# Altium schematic sheet Stm32_Minimum_Board_V1.0.SchDoc
size A3; Razrabotal: Булатов
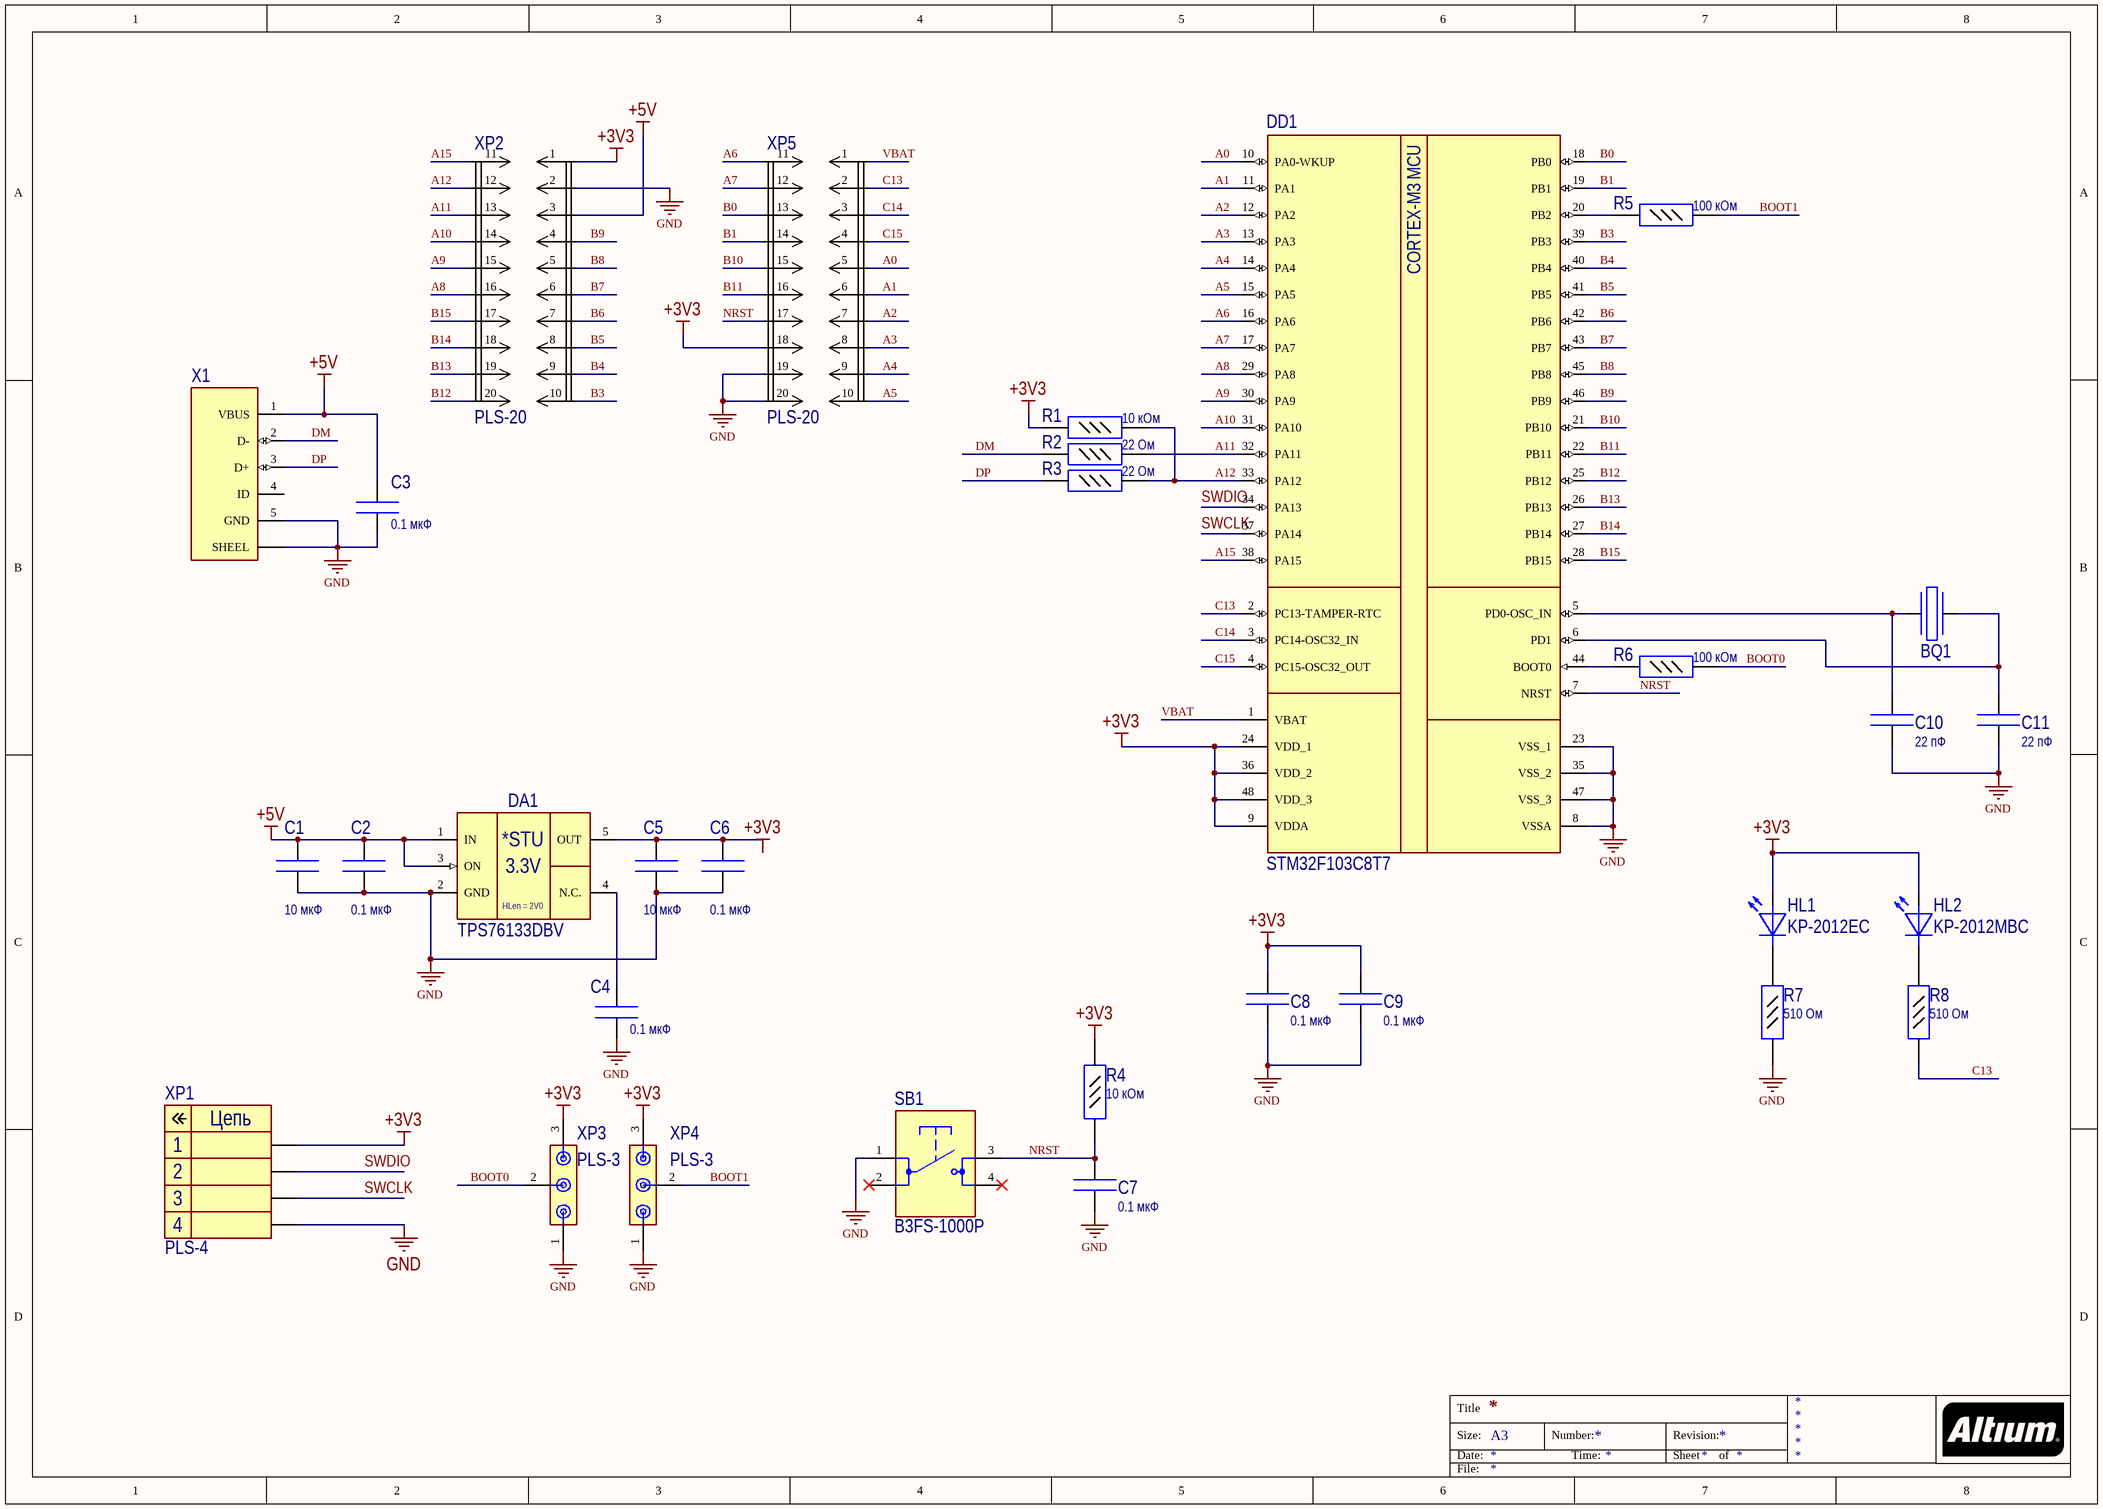
[diagram p0: Stm32_Minimum_Board_V1.0.SchDoc]

## Parts
BQ1  HC-49SMD  [HC49-SMD]  (value not drawn)
C1  value 10 мкФ  [CC0805]  (hidden comment: CC0805-X7R-10 мкФ-20%-25В)
C2  value 0.1 мкФ  [CC0603]  (hidden comment: CC0603-X5R-0.1 мкФ-20%-10В)
C3  value 0.1 мкФ  [CC0603]  (hidden comment: CC0603-X5R-0.1 мкФ-20%-10В)
C4  value 0.1 мкФ  [CC0603]  (hidden comment: CC0603-X5R-0.1 мкФ-20%-10В)
C5  value 10 мкФ  [CC0805]  (hidden comment: CC0805-X7R-10 мкФ-20%-25В)
C6  value 0.1 мкФ  [CC0603]  (hidden comment: CC0603-X5R-0.1 мкФ-20%-10В)
C7  value 0.1 мкФ  [CC0603]  (hidden comment: CC0603-X5R-0.1 мкФ-20%-10В)
C8  value 0.1 мкФ  [CC0603]  (hidden comment: CC0603-X5R-0.1 мкФ-20%-10В)
C9  value 0.1 мкФ  [CC0603]  (hidden comment: CC0603-X5R-0.1 мкФ-20%-10В)
C10  value 22 пФ  [CC0603]  (hidden comment: CC0603-X7R-22 пФ-20%-25В)
C11  value 22 пФ  [CC0603]  (hidden comment: CC0603-X7R-22 пФ-20%-25В)
DA1  TPS76133DBV  [TSOP-5]
DD1  STM32F103C8T7  [LQFP50P700x700-48]
HL1  KP-2012EC  [KP-2012-RED]
HL2  KP-2012MBC  [KP-2012-BL]
R1  value 10 кОм  [CR0603]  (hidden comment: CR0603-10 кОм-±5%)
R2  value 22 Ом  [CR0603]  (hidden comment: CR0603-22 Ом-±5%)
R3  value 22 Ом  [CR0603]  (hidden comment: CR0603-22 Ом-±5%)
R4  value 10 кОм  [CR0603]  (hidden comment: CR0603-10 кОм-±5%)
R5  value 100 кОм  [CR0603]  (hidden comment: CR0603-100 кОм-±5%)
R6  value 100 кОм  [CR0603]  (hidden comment: CR0603-100 кОм-±5%)
R7  value 510 Ом  [CR0603]  (hidden comment: CR0603-510 Ом-±5%)
R8  value 510 Ом  [CR0603]  (hidden comment: CR0603-510 Ом-±5%)
SB1  B3FS-1000P  [B3FS-10xx]
X1  microUSB-AB (475900001 Molex)  [microUSB-AB PCB (475900001 Molex)]  (value not drawn)
XP1  PLS-4  [PLS-4]
XP2  PLS-20  [PLS-20]
XP3  PLS-3  [PLS-3]
XP4  PLS-3  [PLS-3]
XP5  PLS-20  [PLS-20]

## Nets
+3V3: C8.1(+) C9.1(+) DD1.9(VDDA) DD1.24(VDD_1) DD1.36(VDD_2) DD1.48(VDD_3) HL1.1(A) HL2.1(A) R1.2(-) R4.1(+) XP1.1 XP2.1 XP3.3 XP4.3 XP5.18
+5V: C1.1(+) C2.1(+) C3.1(+) DA1.1(IN) DA1.3(ON) X1.1(VBUS) XP2.3
GND: C1.2(-) C2.2(-) C3.2(-) C4.2(-) C5.2(-) C6.2(-) C7.2(-) C8.2(-) C9.2(-) C10.2(-) C11.2(-) DA1.2(GND) DD1.8(VSSA) DD1.23(VSS_1) DD1.35(VSS_2) DD1.47(VSS_3) R7.2(-) SB1.1 X1.5(GND) X1.MH(SHEEL) XP1.4 XP2.2 XP3.1 XP4.1 XP5.19 XP5.20
A0: DD1.10(PA0-WKUP) XP5.5
A1: DD1.11(PA1) XP5.6
A2: DD1.12(PA2) XP5.7
A3: DD1.13(PA3) XP5.8
A4: DD1.14(PA4) XP5.9
A5: DD1.15(PA5) XP5.10
A6: DD1.16(PA6) XP5.11
A7: DD1.17(PA7) XP5.12
A8: DD1.29(PA8) XP2.16
A9: DD1.30(PA9) XP2.15
A10: DD1.31(PA10) XP2.14
A11: DD1.32(PA11) R2.2(-) XP2.13
A12: DD1.33(PA12) R1.1(+) R3.2(-) XP2.12
A15: DD1.38(PA15) XP2.11
B0: DD1.18(PB0) XP5.13
B1: DD1.19(PB1) XP5.14
B3: DD1.39(PB3) XP2.10
B4: DD1.40(PB4) XP2.9
B5: DD1.41(PB5) XP2.8
B6: DD1.42(PB6) XP2.7
B7: DD1.43(PB7) XP2.6
B8: DD1.45(PB8) XP2.5
B9: DD1.46(PB9) XP2.4
B10: DD1.21(PB10) XP5.15
B11: DD1.22(PB11) XP5.16
B12: DD1.25(PB12) XP2.20
B13: DD1.26(PB13) XP2.19
B14: DD1.27(PB14) XP2.18
B15: DD1.28(PB15) XP2.17
BOOT0: R6.2(-) XP3.2
BOOT1: R5.2(-) XP4.2
C13: DD1.2(PC13-TAMPER-RTC) R8.2(-) XP5.2
C14: DD1.3(PC14-OSC32_IN) XP5.3
C15: DD1.4(PC15-OSC32_OUT) XP5.4
DM: R2.1(+) X1.2(D-)
DP: R3.1(+) X1.3(D+)
NRST: C7.1(+) DD1.7(NRST) R4.2(-) SB1.3 XP5.17
SWCLK: DD1.37(PA14) XP1.3
SWDIO: DD1.34(PA13) XP1.2
VBAT: DD1.1(VBAT) XP5.1
NetBQ1_1: BQ1.1 C10.1(+) DD1.5(PD0-OSC_IN)
NetBQ1_2: BQ1.2 C11.1(+) DD1.6(PD1)
NetC4_1: C4.1(+) DA1.4(N.C.)
NetC5_1: C5.1(+) C6.1(+) DA1.5(OUT)
NetDD1_20: DD1.20(PB2) R5.1(+)
NetDD1_44: DD1.44(BOOT0) R6.1(+)
NetHL1_2: HL1.2(K) R7.1(+)
NetHL2_2: HL2.2(K) R8.1(+)

Not connected (* = marked no-connect by the designer): SB1 2* 4*; X1 4(ID)

## Notes on the sheet
- Labels drawn without touching a wire or pin: +3V3
- Title
- Size:
- Date:
- A3
- Number:
- Time:
- Revision:
- Sheet
- of
- File:
- (in symbol PLS-4) Цепь
- (in symbol STM32F103C8T7) MCU; CORTEX-M3
- (in symbol TPS76133DBV) *STU; 3.3V; HLen = 2V0

## Library data of the parts
BQ1 = HC-49SMD: Кварцевый резонатор
C1 C5 = CC0805-X7R-#-20%-25В: Чип конденсатор керамический; Компэл: CC0805KKX7R8BB225; Supplier 1: Farnell; Supplier Part Number 1: 1458904
C2-C4 C6-C9 = CC0603-X5R-#-20%-10В: Чип конденсатор керамический; Компэл: CC0603KRX5R6BB475; Supplier 1: Digi-Key; Supplier Part Number 1: 311-1455-2-ND
C10 C11 = CC0603-X7R-#-20%-25В: Чип конденсатор керамический; Компэл: GRM188R71E105KA12D MUR; Supplier 1: Digi-Key; Supplier Part Number 1: 490-5307-6-ND
DA1 = TPS76133DBV: Стабилизатор 3,3В Vin = 16В, Io =  100 мА, Vdo = 170 мВ; Supplier 1: Digi-Key; Supplier Part Number 1: 296-2695-2-ND
DD1 = STM32F103C8T7: Микроконтроллер 32bit; Supplier 1: Digi-Key; Supplier Part Number 1: 497-11517-ND
HL1 = KP-2012EC: Светодиод красный SMD0805; Supplier 1: Farnell; Supplier Part Number 1: 8529949
HL2 = KP-2012MBC: Светодиод голубой SMD0805; Supplier 1: Farnell; Supplier Part Number 1: 8529876
R1-R8 = CR0603-#-±5%: Чип резистор
SB1 = B3FS-1000P: Кнопка тактовая 3.1мм; Supplier 1: Mouser; Supplier 2: Farnell
X1 = microUSB-AB (475900001 Molex): microUSB SMD
XP1 = PLS-4: Штыри на плату однорядные
XP2 XP5 = PLS-20: Штыри на плату
XP3 XP4 = PLS-3: Штыри на плату однорядные